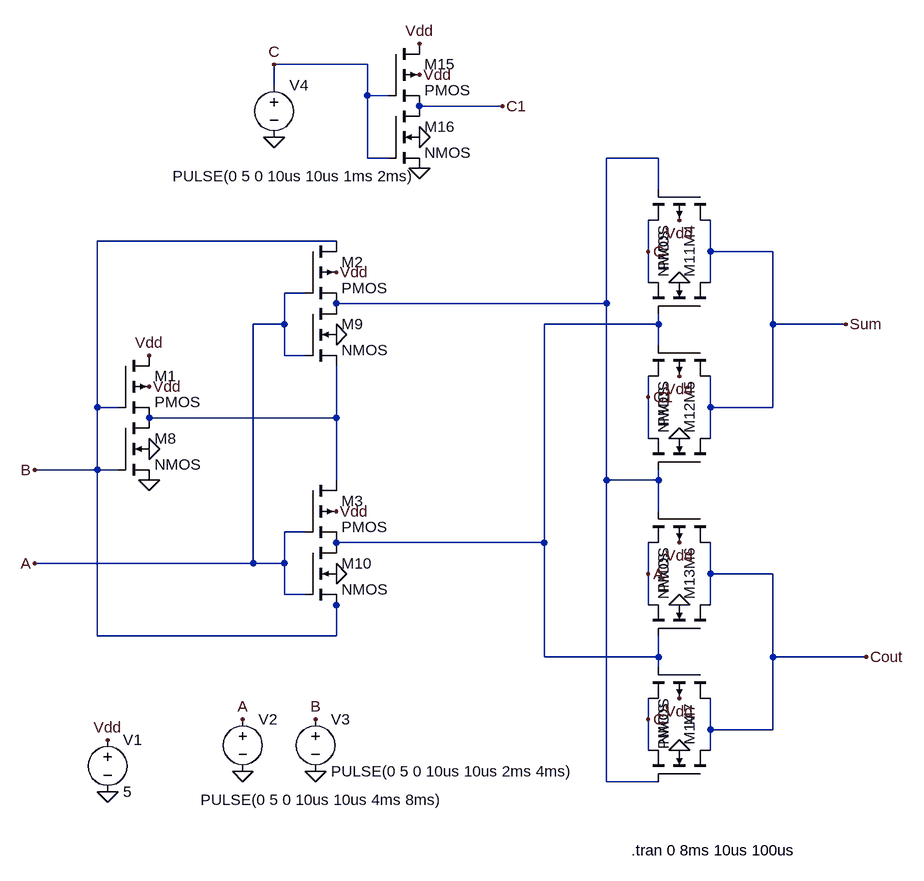
[diagram p0: schematic Adder.asc]
Adder.asc, the LTspice schematic file:
Version 4
SHEET 1 1168 1004
WIRE 320 -256 176 -256
WIRE 176 -224 176 -256
WIRE 320 -208 320 -256
WIRE 352 -208 320 -208
WIRE 528 -192 400 -192
WIRE 320 -112 320 -208
WIRE 352 -112 320 -112
WIRE 768 -112 688 -112
WIRE 768 -64 768 -112
WIRE 272 16 -96 16
WIRE 752 32 752 -16
WIRE 848 32 848 -16
WIRE 944 32 848 32
WIRE 752 80 752 32
WIRE 848 80 848 32
WIRE 224 96 192 96
WIRE 688 112 688 -112
WIRE 688 112 272 112
WIRE 192 144 192 96
WIRE 192 144 144 144
WIRE 768 144 768 128
WIRE 768 144 592 144
WIRE 944 144 944 32
WIRE 1056 144 944 144
WIRE 768 176 768 144
WIRE 192 192 192 144
WIRE 224 192 192 192
WIRE 752 256 752 224
WIRE -96 272 -96 16
WIRE -64 272 -96 272
WIRE 848 272 848 224
WIRE 944 272 944 144
WIRE 944 272 848 272
WIRE 272 288 272 208
WIRE 272 288 -16 288
WIRE 752 320 752 256
WIRE 848 320 848 272
WIRE -96 368 -96 272
WIRE -96 368 -192 368
WIRE -64 368 -96 368
WIRE 272 384 272 288
WIRE 688 384 688 112
WIRE 768 384 768 368
WIRE 768 384 688 384
WIRE 768 432 768 384
WIRE 224 464 192 464
WIRE 592 480 592 144
WIRE 592 480 272 480
WIRE 144 512 144 144
WIRE 144 512 -192 512
WIRE 192 512 192 464
WIRE 192 512 144 512
WIRE 752 528 752 480
WIRE 848 528 848 480
WIRE 944 528 848 528
WIRE 192 560 192 512
WIRE 224 560 192 560
WIRE 272 576 272 560
WIRE 752 576 752 528
WIRE 848 576 848 528
WIRE -96 624 -96 368
WIRE 272 624 272 576
WIRE 272 624 -96 624
WIRE 592 656 592 480
WIRE 768 656 768 624
WIRE 768 656 592 656
WIRE 944 656 944 528
WIRE 1088 656 944 656
WIRE 768 672 768 656
WIRE 752 752 752 720
WIRE 848 768 848 720
WIRE 944 768 944 656
WIRE 944 768 848 768
WIRE 752 800 752 752
WIRE 848 800 848 768
WIRE 688 848 688 384
WIRE 768 848 688 848
FLAG -80 864 0
FLAG -80 784 Vdd
FLAG -16 240 Vdd
FLAG 272 64 Vdd
FLAG 272 432 Vdd
FLAG 800 -16 Vdd
FLAG 800 224 Vdd
FLAG 800 480 Vdd
FLAG 800 720 Vdd
FLAG -16 336 0
FLAG 272 160 0
FLAG 272 528 0
FLAG 800 80 0
FLAG 800 320 0
FLAG 800 576 0
FLAG 800 800 0
FLAG -16 192 Vdd
FLAG -16 384 0
FLAG 128 832 0
FLAG 240 832 0
FLAG -192 512 A
FLAG 128 752 A
FLAG 752 528 A
FLAG 240 752 B
FLAG -192 368 B
FLAG 176 -144 0
FLAG 400 -240 Vdd
FLAG 400 -144 0
FLAG 400 -288 Vdd
FLAG 400 -96 0
FLAG 176 -256 C
FLAG 528 -192 C1
FLAG 752 256 C1
FLAG 752 32 C
FLAG 752 752 C
FLAG 1056 144 Sum
FLAG 1088 656 Cout
SYMBOL pmos4 -64 192 R0
SYMATTR InstName M1
SYMATTR Value2 l=2 w=10
SYMBOL pmos4 224 16 R0
SYMATTR InstName M2
SYMATTR Value2 l=2 w=10
SYMBOL pmos4 224 384 R0
SYMATTR InstName M3
SYMATTR Value2 l=2 w=10
SYMBOL pmos4 848 -64 R90
SYMATTR InstName M4
SYMATTR Value2 l=2 w=10
SYMBOL pmos4 848 176 R90
SYMATTR InstName M5
SYMATTR Value2 l=2 w=10
SYMBOL pmos4 848 432 R90
SYMATTR InstName M6
SYMATTR Value2 l=2 w=10
SYMBOL pmos4 848 672 R90
SYMATTR InstName M7
SYMATTR Value2 l=2 w=10
SYMBOL nmos4 -64 288 R0
SYMATTR InstName M8
SYMATTR Value2 l=2 w=10
SYMBOL nmos4 224 112 R0
SYMATTR InstName M9
SYMATTR Value2 l=2 w=10
SYMBOL nmos4 224 480 R0
SYMATTR InstName M10
SYMATTR Value2 l=2 w=10
SYMBOL nmos4 848 128 M270
SYMATTR InstName M11
SYMATTR Value2 l=2 w=10
SYMBOL nmos4 848 368 M270
SYMATTR InstName M12
SYMATTR Value2 l=2 w=10
SYMBOL nmos4 848 624 M270
SYMATTR InstName M13
SYMATTR Value2 l=2 w=10
SYMBOL nmos4 848 848 M270
SYMATTR InstName M14
SYMATTR Value2 l=2 w=10
SYMBOL voltage -80 768 R0
WINDOW 123 0 0 Left 2
WINDOW 39 0 0 Left 2
SYMATTR InstName V1
SYMATTR Value 5
SYMBOL voltage 128 736 R0
WINDOW 3 -65 140 Left 2
WINDOW 123 0 0 Left 2
WINDOW 39 0 0 Left 2
SYMATTR InstName V2
SYMATTR Value PULSE(0 5 0 10us 10us 4ms 8ms)
SYMBOL voltage 240 736 R0
WINDOW 123 0 0 Left 2
WINDOW 39 0 0 Left 2
SYMATTR InstName V3
SYMATTR Value PULSE(0 5 0 10us 10us 2ms 4ms)
SYMBOL voltage 176 -240 R0
WINDOW 3 -156 156 Left 2
WINDOW 123 0 0 Left 2
WINDOW 39 0 0 Left 2
SYMATTR InstName V4
SYMATTR Value PULSE(0 5 0 10us 10us 1ms 2ms)
SYMBOL pmos4 352 -288 R0
SYMATTR InstName M15
SYMATTR Value2 l=2 w=10
SYMBOL nmos4 352 -192 R0
SYMATTR InstName M16
SYMATTR Value2 l=2 w=10
TEXT 726 954 Left 2 !.tran 0 8ms 10us 100us

The netlist it stands for:
* Adder.asc
M1 Vdd B N003 Vdd PMOS l=2 w=10
M2 B A N001 Vdd PMOS l=2 w=10
M3 N003 A N002 Vdd PMOS l=2 w=10
M4 Sum N001 C Vdd PMOS l=2 w=10
M5 Sum N002 C1 Vdd PMOS l=2 w=10
M6 Cout N001 A Vdd PMOS l=2 w=10
M7 Cout N002 C Vdd PMOS l=2 w=10
M8 N003 B 0 0 NMOS l=2 w=10
M9 N001 A N003 0 NMOS l=2 w=10
M10 N002 A B 0 NMOS l=2 w=10
M11 Sum N002 C 0 NMOS l=2 w=10
M12 Sum N001 C1 0 NMOS l=2 w=10
M13 Cout N002 A 0 NMOS l=2 w=10
M14 Cout N001 C 0 NMOS l=2 w=10
V1 Vdd 0 5
V2 A 0 PULSE(0 5 0 10us 10us 4ms 8ms)
V3 B 0 PULSE(0 5 0 10us 10us 2ms 4ms)
V4 C 0 PULSE(0 5 0 10us 10us 1ms 2ms)
M15 Vdd C C1 Vdd PMOS l=2 w=10
M16 C1 C 0 0 NMOS l=2 w=10
.model NMOS NMOS
.model PMOS PMOS
.lib standard.mos
.tran 0 8ms 10us 100us
.backanno
.end